# EAGLE design ButoMat (EAGLE 7.1.0)
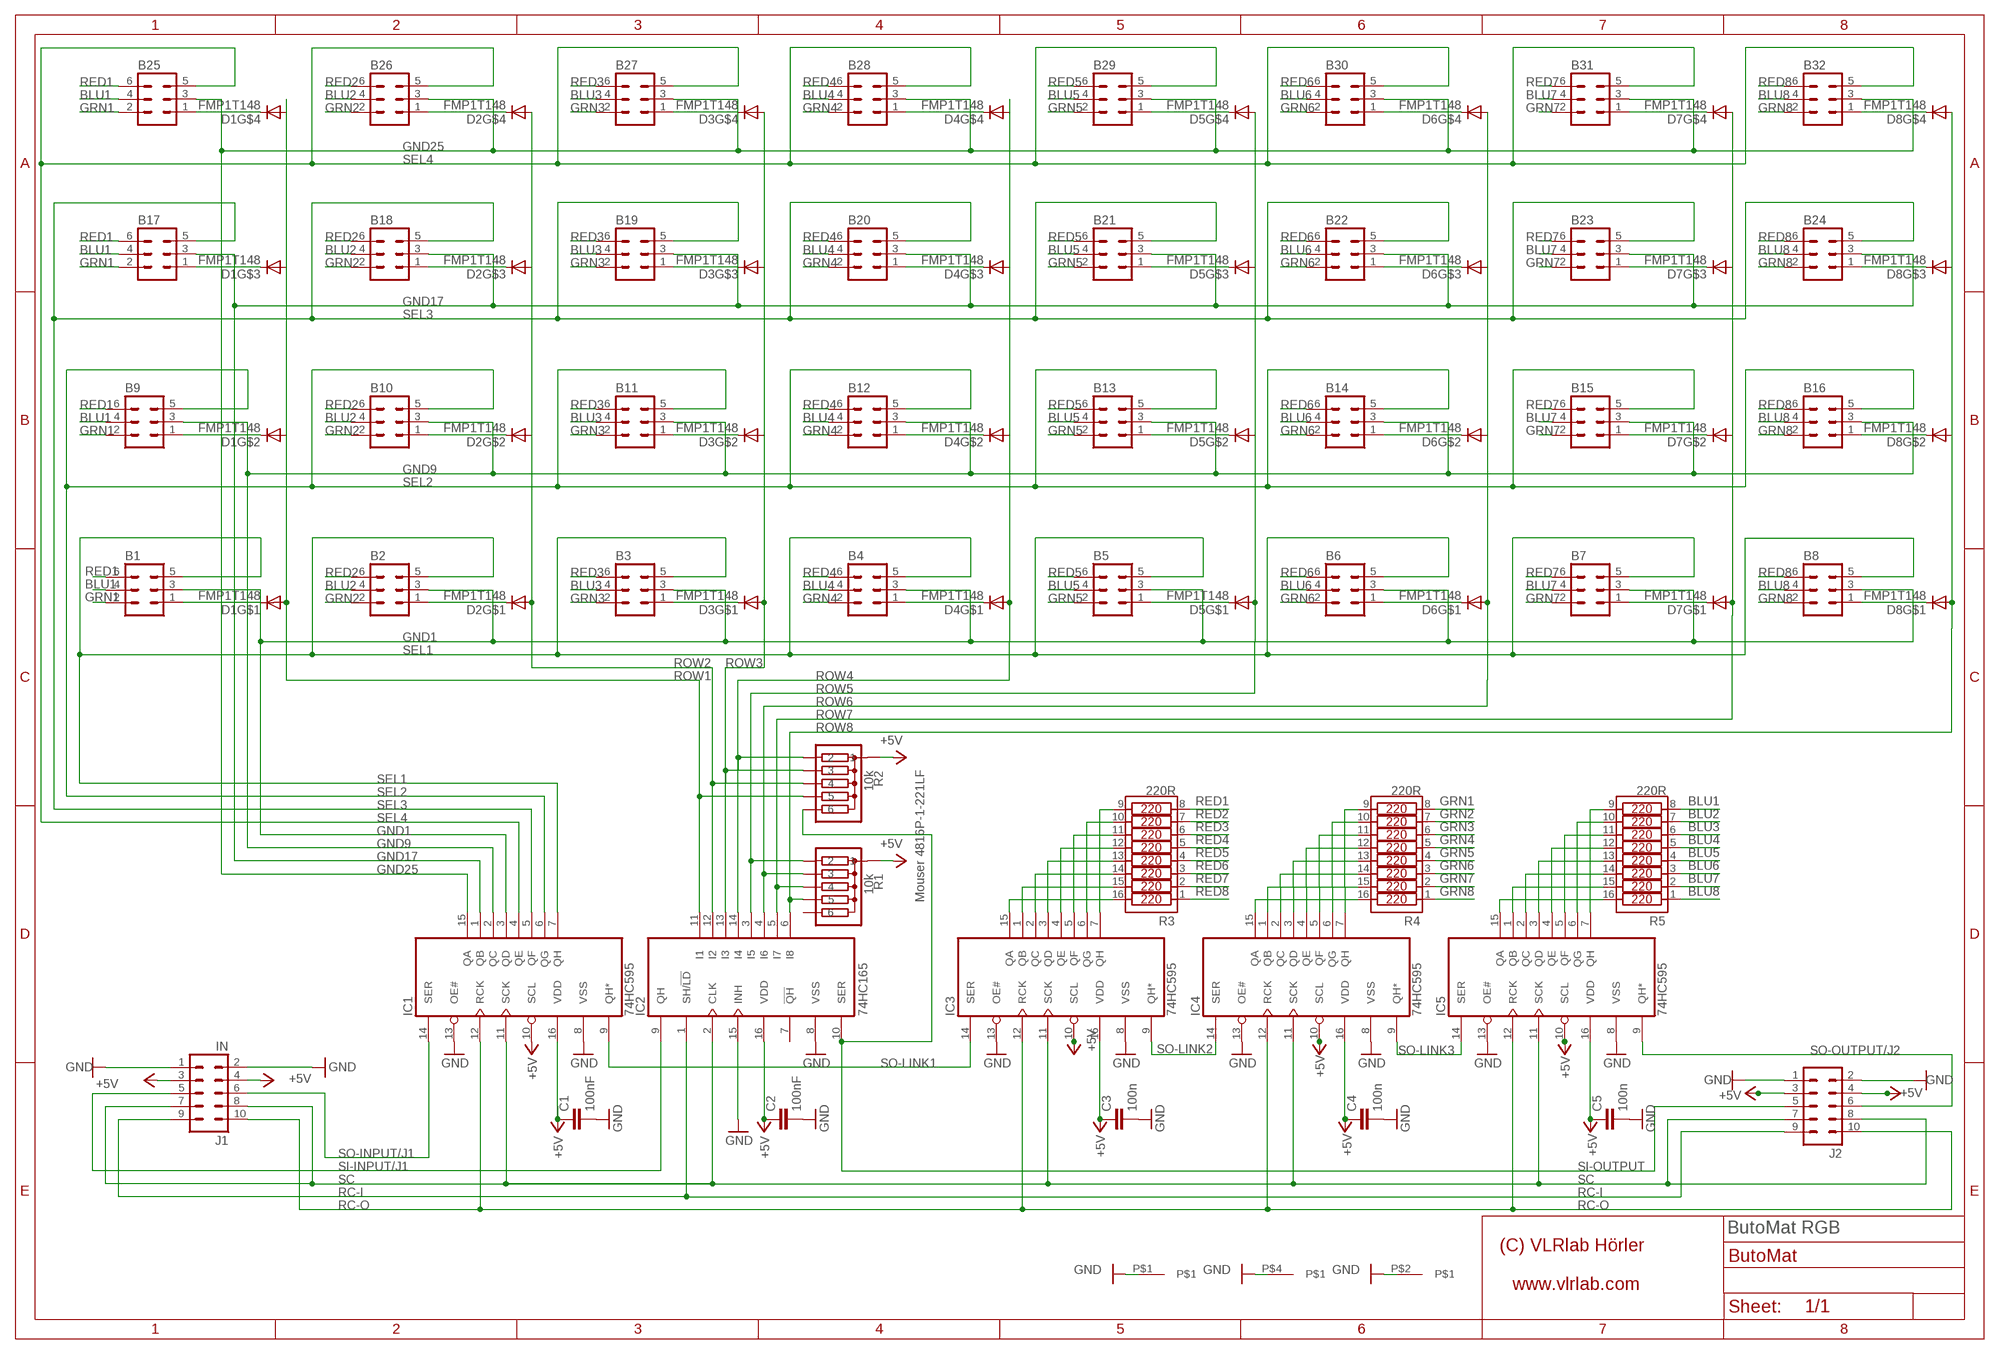
[diagram p0: schematic, sheet 1]

## Parts
B1  ML6  [ML6]
B2  ML6  [ML6]
B3  ML6  [ML6]
B4  ML6  [ML6]
B5  ML6  [ML6]
B6  ML6  [ML6]
B7  ML6  [ML6]
B8  ML6  [ML6]
B9  ML6  [ML6]
B10  ML6  [ML6]
B11  ML6  [ML6]
B12  ML6  [ML6]
B13  ML6  [ML6]
B14  ML6  [ML6]
B15  ML6  [ML6]
B16  ML6  [ML6]
B17  ML6  [ML6]
B18  ML6  [ML6]
B19  ML6  [ML6]
B20  ML6  [ML6]
B21  ML6  [ML6]
B22  ML6  [ML6]
B23  ML6  [ML6]
B24  ML6  [ML6]
B25  ML6  [ML6]
B26  ML6  [ML6]
B27  ML6  [ML6]
B28  ML6  [ML6]
B29  ML6  [ML6]
B30  ML6  [ML6]
B31  ML6  [ML6]
B32  ML6  [ML6]
C1  100nF  C-EU025-030X050  [C025-030X050]
C2  100nF  C-EU025-030X050  [C025-030X050]
C3  100n  C-EU025-030X050  [C025-030X050]
C4  100n  C-EU025-030X050  [C025-030X050]
C5  100n  C-EU025-030X050  [C025-030X050]
D1  FMP1T148  [SC-74A]
D2  FMP1T148  [SC-74A]
D3  FMP1T148  [SC-74A]
D4  FMP1T148  [SC-74A]
D5  FMP1T148  [SC-74A]
D6  FMP1T148  [SC-74A]
D7  FMP1T148  [SC-74A]
D8  FMP1T148  [SC-74A]
IC1  74HC595  74HC595SO16D  [SO16D]
IC2  74HC165  74HC165NSO16D  [SO16D]
IC3  74HC595  74HC595SO16D  [SO16D]
IC4  74HC595  74HC595SO16D  [SO16D]
IC5  74HC595  74HC595SO16D  [SO16D]
J1  IN  ML10  [ML10]
J2  ML10  [ML10]
R1  10k  4306R  [SIL6]
R2  10k  4306R  [SIL6]
R3  220R  4816P-1SOIC16W  [SOIC16W]
R4  220R  4816P-1SOIC16W  [SOIC16W]
R5  220R  4816P-1SOIC16W  [SOIC16W]
U$1  MIDIBOX_HALF  [MIDIBOX14X6]

## Nets
+5V [VDD]: C1.1 C2.1 C3.1 C4.1 C5.1 IC1.10(SCL) IC1.16(VDD) IC2.16(VDD) IC3.10(SCL) IC3.16(VDD) IC4.10(SCL) IC4.16(VDD) IC5.10(SCL) IC5.16(VDD) J1.3 J1.4 J2.3 J2.4 R1.1 R2.1
BLU1: B1.4 B9.4 B17.4 B25.4 R5.8
BLU2: B2.4 B10.4 B18.4 B26.4 R5.7
BLU3: B3.4 B11.4 B19.4 B27.4 R5.6
BLU4: B4.4 B12.4 B20.4 B28.4 R5.5
BLU5: B5.4 B13.4 B21.4 B29.4 R5.4
BLU6: B6.4 B14.4 B22.4 B30.4 R5.3
BLU7: B7.4 B15.4 B23.4 B31.4 R5.2
BLU8: B8.4 B16.4 B24.4 B32.4 R5.1
GND: C1.2 C2.2 C3.2 C4.2 C5.2 IC1.8(VSS) IC1.13(OE#) IC2.8(VSS) IC2.15(INH) IC3.8(VSS) IC3.13(OE#) IC4.8(VSS) IC4.13(OE#) IC5.8(VSS) IC5.13(OE#) J1.1 J1.2 J2.1 J2.2 U$1.P$1 U$1.P$2 U$1.P$4
GND1: B1.3 B2.3 B3.3 B4.3 B5.3 B6.3 B7.3 B8.3 IC1.3(QD)
GND9: B9.3 B10.3 B11.3 B12.3 B13.3 B14.3 B15.3 B16.3 IC1.2(QC)
GND17: B17.3 B18.3 B19.3 B20.3 B21.3 B22.3 B23.3 B24.3 IC1.1(QB)
GND25: B25.3 B26.3 B27.3 B28.3 B29.3 B30.3 B31.3 B32.3 IC1.15(QA)
GRN1: B1.2 B9.2 B17.2 B25.2 R4.8
GRN2: B2.2 B10.2 B18.2 B26.2 R4.7
GRN3: B3.2 B11.2 B19.2 B27.2 R4.6
GRN4: B4.2 B12.2 B20.2 B28.2 R4.5
GRN5: B5.2 B13.2 B21.2 B29.2 R4.4
GRN6: B6.2 B14.2 B22.2 B30.2 R4.3
GRN7: B7.2 B15.2 B23.2 B31.2 R4.2
GRN8: B8.2 B16.2 B24.2 B32.2 R4.1
N$1: B17.1 D1.K$3(C)
N$2: B9.1 D1.K$2(C)
N$3: B1.1 D1.K$1(C)
N$4: B18.1 D2.K$3(C)
N$5: B10.1 D2.K$2(C)
N$6: B2.1 D2.K$1(C)
N$7: B19.1 D3.K$3(C)
N$8: B11.1 D3.K$2(C)
N$9: IC5.15(QA) R5.16
N$10: IC5.1(QB) R5.15
N$11: IC5.2(QC) R5.14
N$12: IC5.3(QD) R5.13
N$13: IC5.4(QE) R5.12
N$14: IC5.5(QF) R5.11
N$15: IC5.6(QG) R5.10
N$16: IC5.7(QH) R5.9
N$17: IC3.15(QA) R3.16
N$18: IC3.1(QB) R3.15
N$19: IC3.2(QC) R3.14
N$20: IC3.3(QD) R3.13
N$21: IC3.4(QE) R3.12
N$22: IC3.5(QF) R3.11
N$23: IC3.6(QG) R3.10
N$24: IC3.7(QH) R3.9
N$25: B25.1 D1.K$4(C)
N$26: B26.1 D2.K$4(C)
N$27: B27.1 D3.K$4(C)
N$28: B28.1 D4.K$4(C)
N$29: B29.1 D5.K$4(C)
N$30: B30.1 D6.K$4(C)
N$31: B31.1 D7.K$4(C)
N$32: B32.1 D8.K$4(C)
N$65: IC4.15(QA) R4.16
N$66: IC4.1(QB) R4.15
N$67: IC4.2(QC) R4.14
N$68: IC4.3(QD) R4.13
N$69: IC4.4(QE) R4.12
N$70: IC4.5(QF) R4.11
N$71: IC4.6(QG) R4.10
N$72: IC4.7(QH) R4.9
N$73: B3.1 D3.K$1(C)
N$74: B20.1 D4.K$3(C)
N$75: B12.1 D4.K$2(C)
N$76: B4.1 D4.K$1(C)
N$77: B21.1 D5.K$3(C)
N$78: B13.1 D5.K$2(C)
N$79: B5.1 D5.K$1(C)
N$80: B22.1 D6.K$3(C)
N$81: B14.1 D6.K$2(C)
N$82: B6.1 D6.K$1(C)
N$83: B7.1 D7.K$1(C)
N$84: B15.1 D7.K$2(C)
N$85: B23.1 D7.K$3(C)
N$86: B24.1 D8.K$3(C)
N$87: B16.1 D8.K$2(C)
N$88: B8.1 D8.K$1(C)
RC-I: IC2.1(SH/!LD) J1.9 J2.9
RC-O: IC1.12(RCK) IC3.12(RCK) IC4.12(RCK) IC5.12(RCK) J1.10 J2.10
RED1: B1.6 B9.6 B17.6 B25.6 R3.8
RED2: B2.6 B10.6 B18.6 B26.6 R3.7
RED3: B3.6 B11.6 B19.6 B27.6 R3.6
RED4: B4.6 B12.6 B20.6 B28.6 R3.5
RED5: B5.6 B13.6 B21.6 B29.6 R3.4
RED6: B6.6 B14.6 B22.6 B30.6 R3.3
RED7: B7.6 B15.6 B23.6 B31.6 R3.2
RED8: B8.6 B16.6 B24.6 B32.6 R3.1
ROW1: D1.ANODE(A) IC2.11(I1) R2.5
ROW2: D2.ANODE(A) IC2.12(I2) R2.4
ROW3: D3.ANODE(A) IC2.13(I3) R2.3
ROW4: D4.ANODE(A) IC2.14(I4) R2.2
ROW5: D5.ANODE(A) IC2.3(I5) R1.2
ROW6: D6.ANODE(A) IC2.4(I6) R1.3
ROW7: D7.ANODE(A) IC2.5(I7) R1.4
ROW8: D8.ANODE(A) IC2.6(I8) R1.5
SC: IC1.11(SCK) IC2.2(CLK) IC3.11(SCK) IC4.11(SCK) IC5.11(SCK) J1.7 J1.8 J2.7 J2.8
SEL1: B1.5 B2.5 B3.5 B4.5 B5.5 B6.5 B7.5 B8.5 IC1.7(QH)
SEL2: B9.5 B10.5 B11.5 B12.5 B13.5 B14.5 B15.5 B16.5 IC1.6(QG)
SEL3: B17.5 B18.5 B19.5 B20.5 B21.5 B22.5 B23.5 B24.5 IC1.5(QF)
SEL4: B25.5 B26.5 B27.5 B28.5 B29.5 B30.5 B31.5 B32.5 IC1.4(QE)
SI-INPUT/J1: IC2.9(QH) J1.5
SI-OUTPUT: IC2.10(SER) J2.5 R2.6
SO-INPUT/J1: IC1.14(SER) J1.6
SO-LINK1: IC1.9(QH*) IC3.14(SER)
SO-LINK2: IC3.9(QH*) IC4.14(SER)
SO-LINK3: IC4.9(QH*) IC5.14(SER)
SO-OUTPUT/J2: IC5.9(QH*) J2.6
Unconnected: IC2.7(!QH) R1.6

## Notes on the sheet
- Mouser 4816P-1-221LF
- ButoMat RGB

## Library data of the parts
B1-B32 = con-ml_Ivan:ML6: HARTING; OC_FARNELL: unknown; OC_NEWARK: unknown
C1-C5 = rcl:C-EU: CAPACITOR, European symbol
D1-D8 = Diode:FMP1T148
IC1 IC3-IC5 = 595-541-165-uln2803:74HC595
IC2 = 595-541-165-uln2803:74HC165N
J1 = con-harting-ml:ML10: HARTING; OC_FARNELL: unknown; OC_NEWARK: unknown
J2 = con-ml:ML10: HARTING; OC_FARNELL: unknown; OC_NEWARK: unknown
R1 R2 = Bourns Resistor Array:4306R
R3-R5 = Bourns Resistor Array:4816P-1
U$1 = Frames_VLR:MIDIBOX_HALF

## Net classes
1 VDD: width 0.61 mm, drill 0.33 mm, clearance 0.355 mm to class 0, clearance 0.355 mm

## Board
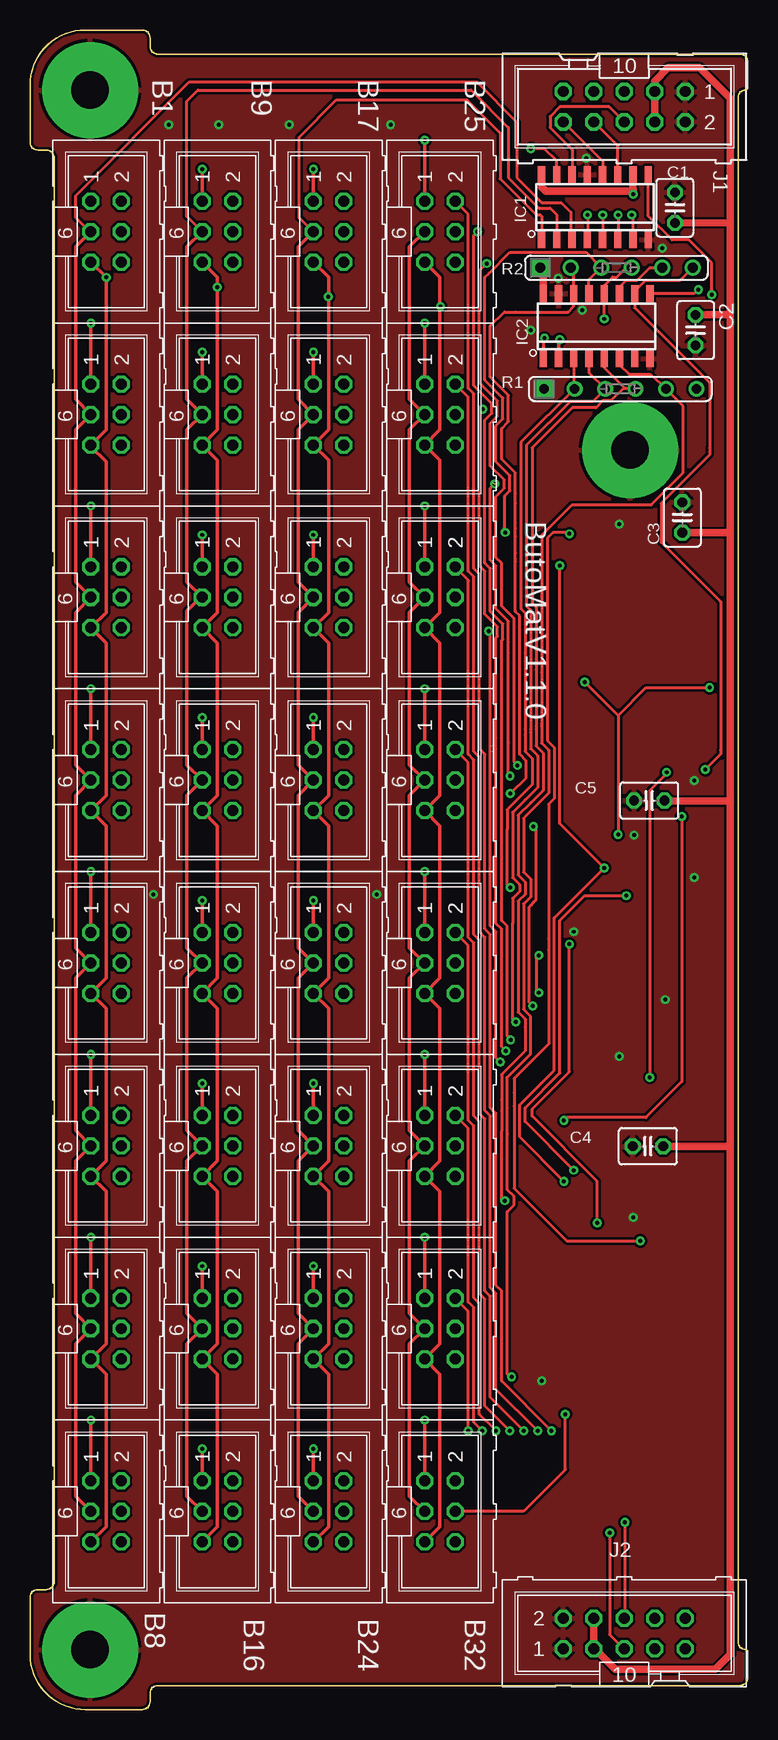
[diagram p1: board, top side]
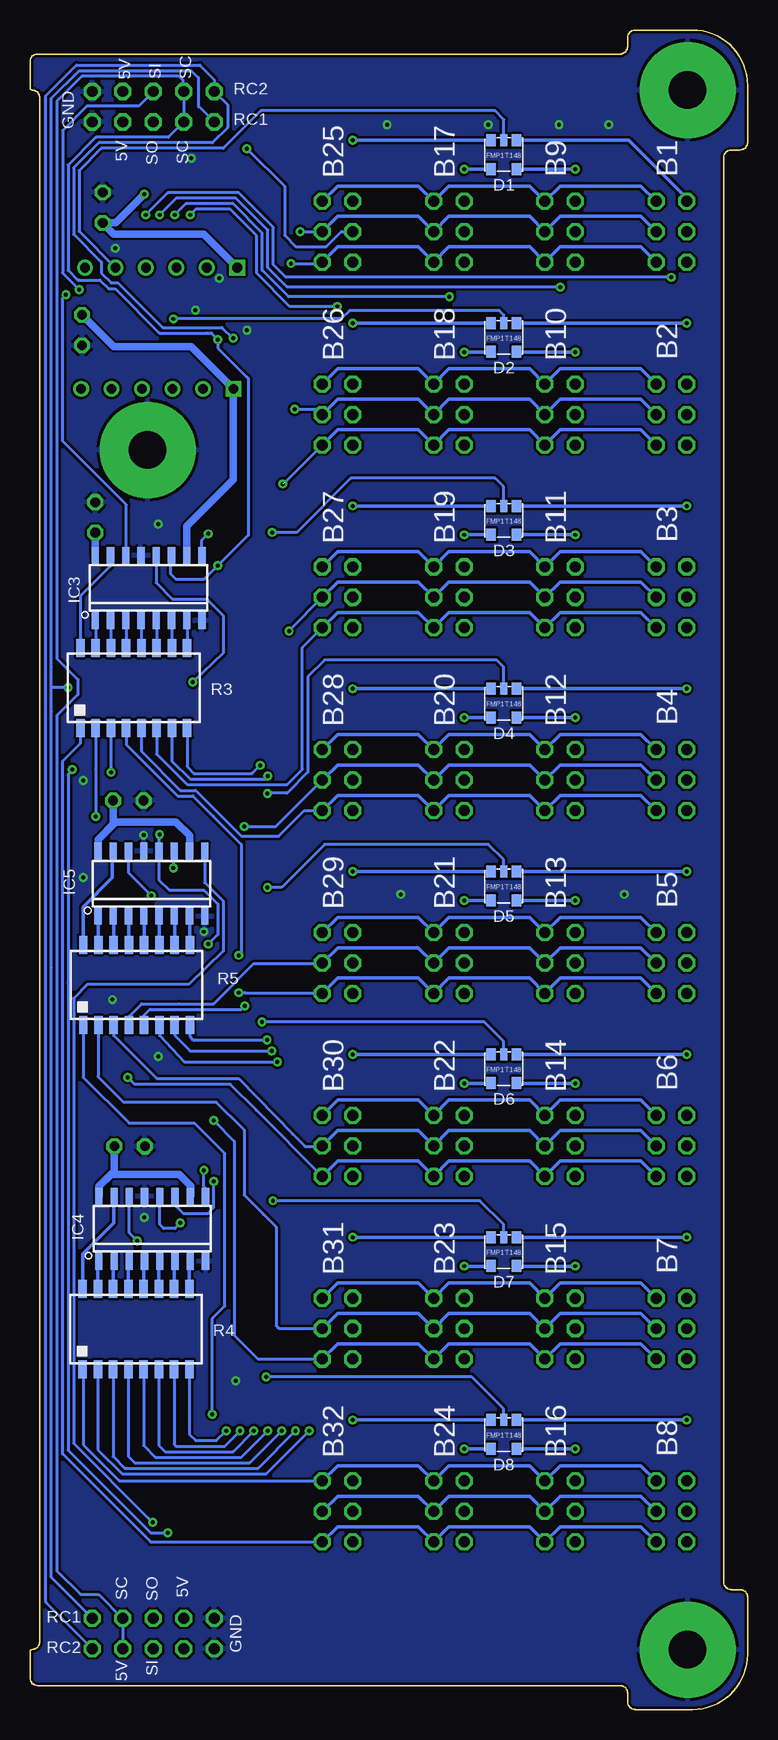
[diagram p2: board, bottom side, seen from below]

Size 59.8 x 140 mm. Coordinates in mm from the lower left corner, seen from the top.
Copper layers (1*16): Top 0.035mm / dielectric 1.5mm / Bottom 0.035mm
Design rules "default *": minimum track width 10mil, minimum drill 24mil, track to track 8mil, track to pad 8mil, pad to pad 8mil, via to via 8mil, smd to smd 8mil, copper to edge 8mil, drill to drill 8mil, minimum pad ring 10mil, minimum via ring 8mil, stop-mask expansion 4mil, vias tented up to drill 0mil, thermal gap 10mil

### Footprints (pad centres in the part's own frame; a part is rotated, then mirrored left to right if it is on the bottom)
ML6 = drill 0.914 octagon: 1 -2.54,-1.27; 2 -2.54,1.27; 3 0,-1.27; 4 0,1.27; 5 2.54,-1.27; 6 2.54,1.27
C025-030X050 = drill 0.813 octagon: 1 -1.27,0; 2 1.27,0
SC-74A = smd 0.6 x 1: ANODE 0,0 | smd 0.8 x 1: K$1 -1.05,0; K$2 -1.05,2.4; K$3 1.05,2.4; K$4 1.05,0
SO16D = smd 0.6 x 1.4: 1 -4.481,-2.764; 2 -3.211,-2.764; 3 -1.941,-2.764; 4 -0.671,-2.764; 5 0.599,-2.764; 6 1.869,-2.764; 7 3.139,-2.764; 8 4.409,-2.764; 9 4.409,2.666; 10 3.139,2.666; 11 1.869,2.666; 12 0.599,2.666; 13 -0.671,2.666; 14 -1.941,2.666; 15 -3.211,2.666; 16 -4.481,2.666
ML10 = drill 0.914 octagon: 1 -5.08,-1.27; 2 -5.08,1.27; 3 -2.54,-1.27; 4 -2.54,1.27; 5 0,-1.27; 6 0,1.27; 7 2.54,-1.27; 8 2.54,1.27; 9 5.08,-1.27; 10 5.08,1.27
SIL6 = drill 0.813 square: 1 -6.35,0 | drill 0.813: 2 -3.81,0; 3 -1.27,0; 4 1.27,0; 5 3.81,0; 6 6.35,0
SOIC16W = smd 0.7 x 1.5: 1 -4.445,-3.346; 2 -3.175,-3.346; 3 -1.905,-3.346; 4 -0.635,-3.346; 5 0.635,-3.346; 6 1.905,-3.346; 7 3.175,-3.346; 8 4.445,-3.346; 9 4.445,3.346; 10 3.175,3.346; 11 1.905,3.346; 12 0.635,3.346; 13 -0.635,3.346; 14 -1.905,3.346; 15 -3.175,3.346; 16 -4.445,3.346
MIDIBOX14X6 = drill 3.1 pad 8: P$1 5,135; P$2 50,105; P$4 5,5

### Placement (x,y rotation side)
B1  6.35,123.19 270 top
B2  6.35,107.95 270 top
B3  6.35,92.71 270 top
B4  6.35,77.47 270 top
B5  6.35,62.23 270 top
B6  6.35,46.99 270 top
B7  6.35,31.75 270 top
B8  6.35,16.51 270 top
B9  15.62,123.19 270 top
B10  15.62,107.95 270 top
B11  15.62,92.71 270 top
B12  15.62,77.47 270 top
B13  15.62,62.23 270 top
B14  15.62,46.99 270 top
B15  15.62,31.75 270 top
B16  15.62,16.51 270 top
B17  24.89,123.19 270 top
B18  24.89,107.95 270 top
B19  24.89,92.71 270 top
B20  24.89,77.47 270 top
B21  24.89,62.23 270 top
B22  24.89,46.99 270 top
B23  24.89,31.75 270 top
B24  24.89,16.51 270 top
B25  34.16,123.19 270 top
B26  34.16,107.95 270 top
B27  34.16,92.71 270 top
B28  34.16,77.47 270 top
B29  34.16,62.23 270 top
B30  34.16,46.99 270 top
B31  34.16,31.75 270 top
B32  34.16,16.51 270 top
C1  53.74,125.19 90 top
C2  55.46,114.98 270 top
C3  54.36,99.36 90 top
C4  51.5,46.95 180 top
C5  51.61,75.76 180 top
D1  20.32,130.81 180 bottom
D2  20.32,115.57 180 bottom
D3  20.32,100.33 180 bottom
D4  20.32,85.09 180 bottom
D5  20.32,69.85 180 bottom
D6  20.32,54.61 180 bottom
D7  20.32,39.37 180 bottom
D8  20.32,24.13 180 bottom
IC1  47.11,125.27 0 top
IC2  47.25,115.36 0 top
IC3  49.88,93.53 0 bottom
IC4  49.58,40.12 0 bottom
IC5  49.65,68.89 0 bottom
J1  49.53,133.6 180 top
J2  49.53,6.35 0 top
R1  49.19,110.09 0 top
R2  48.87,120.19 0 top
R3  51.15,85.15 0 bottom
R4  50.97,31.7 0 bottom
R5  50.92,60.4 0 bottom
U$1  0,0 0 top
U$3  [VLRLAB]  48.9,33.02 270 top

### Tracks (layer width: path | path; a pad name or v marks a point on that pad's centre or on a via)
+5V  (via drill 0.33)
  Top 0.406: 42.99,126.55 50.04,126.55 50.27,126.61 50.25,126.99 50.27,127.13 50.27,127.24
  Top 0.61: 58.36,46.95 58.36,4.62 57.09,3.35 48.77,3.35 47.04,5.08 J2.3 J2.4 | 58.36,46.95 58.36,75.74 | 58.36,75.74 58.36,98.12 | 58.36,98.12 58.36,101.01 58.36,116.26 | 58.36,116.26 58.36,123.89 | 58.36,123.89 58.36,134.29 55.82,136.84 53.16,136.84 52.07,135.74 J1.3 J1.4 | C2.1 56.32,116.26 58.36,116.26 | R2.1 42.77,119.94 IC2.16 | C5.1 52.9,75.74 58.36,75.74 | C4.1 58.36,46.95 | IC1.16 42.65,127.92 42.65,126.9 42.99,126.55 50.04,126.55 50.27,126.61 | IC1.10 50.25,126.99 50.27,126.61 | C3.1 54.38,98.12 58.36,98.12 | v50.27,126.32 50.27,126.61 | 58.36,123.89 C1.1
  Bottom 0.61: R2.1 45.3,122.97 52.81,122.97 C1.1 52.67,123.92 v50.27,126.32 | C2.1 55.43,116.22 52.81,113.61 46.36,113.61 R1.1 42.84,102.52 46.74,98.63 IC3.10 | IC3.16 54.36,96.9 C3.1 | IC5.10 46.51,72.84 47.63,73.97 52.7,73.97 54.13,72.53 IC5.16 54.13,72.51 52.7,73.93 52.7,73.96 52.88,74.01 C5.1 | IC4.10 46.41,42.82 46.41,43.64 47.38,44.61 53.05,44.61 54.06,43.6 IC4.16 54.03,42.82 54.03,43.64 53.03,44.63 53.01,44.63 52.77,44.87 C4.1
BLU1  (via drill 0.33)
  Top 0.254: v40.05,55.82 40.1,55.82 39.76,56.17 39.76,65.3 39.29,65.76 39.29,80.32 39.29,81.25 39.29,89.1 39.41,89.22 39.41,90.49 38.37,91.53 38.37,95.11 37.91,95.58 37.91,107.48 38.48,108.06 38.48,108.87 36.98,110.37 36.98,122.89 v37.29,123.2
  Bottom 0.254: R5.8 46.48,56.18 46.23,55.82 46,55.82 v40.05,55.82 | v37.29,123.2 35.44,123.2 B25.4
  Bottom 0.305: B1.4 8.89,124.46 15.62,124.46 B9.4 18.16,124.46 24.89,124.46 B17.4 27.43,124.46 34.16,124.46 B25.4
BLU2  (via drill 0.33)
  Top 0.254: 39.29,55.7 | 39.29,55.7 39.29,65.07 38.83,65.53 38.83,80.09 38.83,81.02 38.83,89.34 38.95,89.45 38.95,90.26 37.91,91.3 37.91,94.88 37.45,95.34 37.45,108.17 v37.73,108.41 | v39.64,54.9 39.29,55.24 39.29,55.7 | 39.29,55.7
  Bottom 0.254: v37.73,108.41 35.89,108.41 B26.4 | R5.7 47.73,57.04 47.73,56.17 46.46,54.9 v39.64,54.9
  Bottom 0.305: B2.4 8.89,109.22 15.62,109.22 B10.4 18.16,109.22 24.89,109.22 B18.4 27.43,109.22 34.16,109.22 B26.4
BLU3  (via drill 0.33)
  Top 0.254: v39.18,53.97 38.83,54.32 38.83,64.83 38.37,65.3 38.37,79.86 38.37,80.32 38.37,89.68 38.14,89.91 v38.21,89.91
  Bottom 0.254: R5.6 49,56.17 46.94,53.98 | 46.94,53.98 | 46.94,53.98 v39.18,53.97 | v38.21,89.91 38.11,90.03 B27.4
  Bottom 0.305: B3.4 8.89,93.98 15.62,93.98 B11.4 18.16,93.98 24.89,93.98 B19.4 27.43,93.98 34.16,93.98 B27.4
BLU4  (via drill 0.33)
  Top 0.254: v41.89,58.65 41.6,58.94 41.6,66.92 41.72,67.03 41.95,67.26 42.18,67.49 42.18,69.46 42.18,70.03 42.18,73.27 v41.95,73.62
  Bottom 0.254: B28.4 35.48,77.43 39.3,73.61 39.31,73.62 v41.95,73.62 | R5.5 50.29,57.89 50.27,57.9 49.81,58.36 42.18,58.36 v41.89,58.65
  Bottom 0.305: B4.4 8.89,78.74 15.62,78.74 B12.4 18.16,78.74 24.89,78.74 B20.4 27.43,78.74 34.16,78.74 B28.4
BLU5
  Bottom 0.254: B29.4 35.49,62.18 40.91,62.18 41.14,62.18 44.49,58.83 47.38,58.83 50.5,58.83 51.54,57.78 51.56,57.77 R5.4
  Bottom 0.305: B5.4 8.89,63.5 15.62,63.5 B13.4 18.16,63.5 24.89,63.5 B21.4 27.43,63.5 34.16,63.5 B29.4
BLU6
  Bottom 0.254: R5.3 52.83,56.18 49.23,52.58 42.41,52.58 37.91,47.96 36.87,46.92 35.5,46.92 B30.4
  Bottom 0.305: B6.4 8.89,48.26 15.62,48.26 B14.4 18.16,48.26 24.89,48.26 B22.4 27.43,48.26 34.16,48.26 B30.4
BLU7
  Bottom 0.254: R5.2 54.1,52.82 54.1,52.71 52.01,50.62 44.26,50.62 42.07,48.42 41.95,48.31 41.95,42.88 40.33,41.26 | 40.33,41.26 | 40.33,41.26 39.29,40.22 39.29,32.01 39.06,31.78 35.47,31.78 B31.4
  Bottom 0.305: B7.4 8.89,33.02 15.62,33.02 B15.4 18.16,33.02 24.89,33.02 B23.4 27.43,33.02 34.16,33.02 B31.4
BLU8  (via drill 0.33)
  Top 0.254: B32.4 35.45,16.53 41.14,16.53 44.61,19.99 v44.61,24.62
  Bottom 0.254: R5.1 55.37,52.71 51.54,48.89 46.11,48.89 44.61,47.38 43.57,46.34 43.57,33.63 44.61,32.59 v44.61,24.62
  Bottom 0.305: B8.4 8.89,17.78 15.62,17.78 B16.4 18.16,17.78 24.89,17.78 B24.4 27.43,17.78 34.16,17.78 B32.4
GND  (via drill 0.33)
  other vias: 46.34,129.32 50.34,72.88 44.03,119.33 52.7,121.81 46.01,116.64 55.36,77.43 55.36,69.34 49.12,98.81 52.93,59.17 49.12,54.43 50.27,41.03 42.65,27.39 10.29,67.96 28.89,67.96 45.3,64.83 11.56,132.1 15.72,132.1 30.05,132.1 21.61,132.1 41.72,114.99
  pour Top: 0,140 60,140 60,0 0,0
  pour Bottom: 0,140 60,140 60,0 0,0
GND1
  Top 0.254: B1.3 4.98,123.19 3.81,124.35 3.81,126.2 13.29,135.68 37.21,135.68 40.56,132.33 40.56,127.7 42.65,125.62 44.26,125.62 45.07,124.82 45.07,122.61 IC1.3
  Top 0.305: B1.3 3.81,121.92 3.81,109.22 B2.3 3.81,106.68 3.81,93.98 B3.3 3.81,91.44 3.81,78.74 B4.3 3.81,76.2 3.81,63.5 B5.3 3.81,60.96 3.81,48.26 B6.3 3.81,45.72 3.81,33.02 B7.3 3.81,30.48 3.81,17.78 B8.3
GND9
  Top 0.254: B9.3 14.34,123.19 13.06,124.47 13.06,134.06 13.98,134.99 36.75,134.99 39.87,131.87 39.87,127.7 42.41,125.16 43.34,125.16 43.92,124.58 43.92,122.53 IC1.2
  Top 0.305: B16.3 13.08,17.78 13.08,30.48 B15.3 13.08,33.02 13.08,45.72 B14.3 13.08,48.26 13.08,60.96 B13.3 13.08,63.5 13.08,76.2 B12.3 13.08,78.74 13.08,91.57 14.22,92.71 B11.3 13.08,93.98 13.08,106.68 B10.3 13.08,109.22 13.08,121.92 B9.3
GND17
  Top 0.254: B17.3 23.58,123.19 22.42,124.35 22.42,131.06 25.54,134.18 36.41,134.18 39.18,131.4 39.18,127.59 42.18,124.58 42.53,124.58 42.65,124.47 42.65,122.53 IC1.1
  Top 0.305: B17.3 22.35,121.92 22.35,109.22 B18.3 22.35,106.68 22.35,93.98 B19.3 22.35,91.44 22.35,78.74 B20.3 22.35,76.2 22.35,63.5 B21.3 22.35,60.96 22.35,48.26 B22.3 22.35,45.72 22.35,33.02 B23.3 22.35,30.48 22.35,17.78 B24.3
GND25  (via drill 0.33)
  Top 0.203: IC1.15 43.88,127.94
  Top 0.254: 43.88,127.94 43.88,129.1 42.86,130.11 v41.74,130.11
  Top 0.305: B25.3 31.62,121.92 31.62,111.76 31.62,109.22 B26.3 31.62,106.68 31.62,93.98 B27.3 31.62,91.44 31.62,78.74 B28.3 31.62,76.2 31.62,63.5 B29.3 31.62,60.96 31.62,48.26 B30.3 31.62,45.72 31.62,33.02 B31.3 31.62,30.48 31.62,17.78 B32.3
  Bottom 0.254: v41.74,130.11 38.59,126.96 38.59,122.88 37.66,121.95 35.09,121.95 33.85,123.19 B25.3
GRN1  (via drill 0.33)
  Top 0.254: v43.45,23.23 39.29,27.39 39.29,34.9 38.83,35.36 38.83,49.7 38.37,50.16 38.37,64.6 37.91,65.07 37.91,79.63 37.45,80.09 37.45,94.65 36.98,95.11 36.98,109.68 36.52,110.14 36.52,124.64 B25.2
  Bottom 0.254: R4.8 46.52,22.94 46,22.42 44.26,22.42 v43.45,23.23
  Bottom 0.305: B1.2 8.89,127 15.62,127 B9.2 18.16,127 24.89,127 B17.2 27.43,127 34.16,127 B25.2
GRN2  (via drill 0.33)
  Top 0.254: v42.3,23.23 38.83,26.7 38.83,34.67 38.37,35.13 38.37,49.46 37.91,49.93 37.91,64.37 37.45,64.83 37.45,79.4 36.98,79.86 36.98,94.42 36.52,94.88 36.52,109.33 36.52,109.4 B26.2
  Bottom 0.254: R4.7 47.79,22.13 47.62,21.96 43.57,21.96 v42.3,23.23
  Bottom 0.305: B2.2 8.89,111.76 15.62,111.76 B10.2 18.16,111.76 24.77,111.76 24.89,111.76 B18.2 27.43,111.76 34.16,111.76 B26.2
GRN3  (via drill 0.33)
  Top 0.254: v41.14,23.23 38.37,26 38.37,34.44 37.91,34.9 37.91,49.23 37.45,49.7 37.45,64.14 36.98,64.6 36.98,79.17 36.52,79.63 36.52,94.07 | 36.52,94.07 36.52,94.16 | 36.52,94.16 36.52,94.07 | 36.52,94.07 36.52,94.16 | 36.52,94.16 B27.2
  Bottom 0.254: R4.6 49.06,22.02 48.54,21.5 42.88,21.5 v41.14,23.23
  Bottom 0.305: B3.2 8.89,96.52 15.62,96.52 B11.2 18.16,96.52 24.89,96.52 B19.2 27.43,96.52 34.16,96.52 B27.2
GRN4  (via drill 0.33)
  Top 0.254: v39.99,23.23 37.91,25.31 37.91,34.21 37.45,34.67 37.45,49 | 37.45,49 | 37.45,49 36.98,49.46 36.98,63.91 | 36.98,63.91 | 36.98,63.91 36.52,64.37 36.52,78.92 | 36.52,78.92 36.52,78.93 36.52,78.92 | 36.52,78.92 B28.2
  Bottom 0.254: R4.5 50.33,22.02 49.35,21.03 42.18,21.03 v39.99,23.23
  Bottom 0.305: B4.2 8.89,81.28 15.62,81.28 B12.2 18.16,81.28 24.89,81.28 B20.2 27.43,81.28 34.16,81.28 B28.2
GRN5  (via drill 0.33)
  Top 0.254: v38.83,23.23 38.72,23.34 37.45,24.62 37.45,33.86 36.98,34.32 36.98,48.66 36.52,49.12 36.52,63.68 | 36.52,63.68 | 36.52,63.68 B29.2
  Bottom 0.254: R4.4 51.6,21.09 51.08,20.57 41.49,20.57 v38.83,23.23
  Bottom 0.305: B5.2 8.89,66.04 15.62,66.04 B13.2 18.16,66.04 24.89,66.04 B21.2 27.43,66.04 34.16,66.04 B29.2
GRN6  (via drill 0.33)
  Top 0.254: v37.68,23.23 36.98,23.92 36.98,33.52 36.52,33.98 36.52,48.42 36.52,48.44 B30.2
  Bottom 0.254: R4.3 52.87,21.09 51.89,20.11 40.8,20.11 v37.68,23.23
  Bottom 0.305: B6.2 8.89,50.8 15.62,50.8 B14.2 18.16,50.8 24.89,50.8 B22.2 27.43,50.8 34.16,50.8 B30.2
GRN7  (via drill 0.33)
  Top 0.254: v36.52,23.23 36.52,33.2 B31.2
  Bottom 0.254: R4.2 54.14,21.66 52.12,19.65 40.1,19.65 v36.52,23.23
  Bottom 0.305: B7.2 8.89,35.56 15.62,35.56 B15.2 18.16,35.56 24.89,35.56 B23.2 27.43,35.56 34.16,35.56 B31.2
GRN8
  Bottom 0.254: R4.1 55.41,27.79 55.36,27.74 55.36,22.07 52.35,19.07 35.45,19.07 B32.2
  Bottom 0.305: B8.2 8.89,20.32 15.62,20.32 B16.2 18.16,20.32 24.89,20.32 B24.2 27.43,20.32 34.16,20.32 B32.2
N$1  (via drill 0.33)
  Top 0.305: v23.62,128.4 B17.1
  Bottom 0.305: D1.K$3 21.38,128.4 v23.62,128.4
N$2  (via drill 0.33)
  Top 0.305: v14.35,128.4 B9.1
  Bottom 0.305: D1.K$2 19.26,128.4 v14.35,128.4
N$3
  Bottom 0.305: D1.K$1 10.54,130.81 10.29,130.81 9.91,130.81 5.08,125.98 B1.1
N$4  (via drill 0.33)
  Top 0.305: v23.62,113.16 B18.1
  Bottom 0.305: D2.K$3 21.38,113.16 v23.62,113.16
N$5  (via drill 0.33)
  Top 0.305: v14.35,113.16 B10.1
  Bottom 0.305: D2.K$2 19.26,113.16 v14.35,113.16
N$6  (via drill 0.33)
  Top 0.305: v5.08,115.57 B2.1
  Bottom 0.305: D2.K$1 v5.08,115.57
N$7  (via drill 0.33)
  Top 0.305: v23.62,97.92 B19.1
  Bottom 0.305: D3.K$3 21.38,97.92 v23.62,97.92
N$8  (via drill 0.33)
  Top 0.305: v14.35,97.92 B11.1
  Bottom 0.305: D3.K$2 19.26,97.92 v14.35,97.92
N$9
  Bottom 0.305: IC5.15 52.93,71.48 52.93,69.34 55.37,66.91 R5.16
N$10
  Bottom 0.305: IC5.1 54.1,66.09 R5.15
N$11
  Bottom 0.305: IC5.2 52.83,66.09 R5.14
N$12
  Bottom 0.305: IC5.3 51.56,66.09 R5.13
N$13
  Bottom 0.305: IC5.4 50.29,66.09 R5.12
N$14
  Bottom 0.305: IC5.5 49.02,66.09 R5.11
N$15
  Bottom 0.305: IC5.6 47.75,66.09 R5.10
N$16
  Bottom 0.305: IC5.7 46.48,66.09 R5.9
N$17
  Bottom 0.254: IC3.15 53.1,96.19 53.1,95.31 55.6,92.81 R3.16
N$18
  Bottom 0.254: IC3.1 54.33,90.73 R3.15
N$19
  Bottom 0.254: IC3.2 53.06,90.73 R3.14
N$20
  Bottom 0.254: IC3.3 51.79,90.73 R3.13
N$21
  Bottom 0.254: IC3.4 50.52,90.73 R3.12
N$22
  Bottom 0.254: IC3.5 49.25,90.73 R3.11
N$23
  Bottom 0.254: IC3.6 47.98,90.73 R3.10
N$24
  Bottom 0.254: IC3.7 46.71,90.73 R3.9
N$25  (via drill 0.33)
  Top 0.305: v32.89,130.81 B25.1
  Bottom 0.305: D1.K$4 v32.89,130.81
N$26  (via drill 0.33)
  Top 0.305: v32.89,115.57 B26.1
  Bottom 0.305: D2.K$4 v32.89,115.57
N$27  (via drill 0.33)
  Top 0.305: v32.89,100.33 B27.1
  Bottom 0.305: D3.K$4 v32.89,100.33
N$28  (via drill 0.33)
  Top 0.305: v32.89,85.09 B28.1
  Bottom 0.305: D4.K$4 v32.89,85.09
N$29  (via drill 0.33)
  Top 0.305: v32.89,69.85 B29.1
  Bottom 0.305: D5.K$4 v32.89,69.85
N$30  (via drill 0.33)
  Top 0.305: v32.89,54.61 B30.1
  Bottom 0.305: D6.K$4 v32.89,54.61
N$31  (via drill 0.33)
  Top 0.305: v32.89,39.37 B31.1
  Bottom 0.305: D7.K$4 v32.89,39.37
N$32  (via drill 0.33)
  Top 0.305: v32.89,24.13 B32.1
  Bottom 0.305: D8.K$4 v32.89,24.13
N$65
  Bottom 0.305: IC4.15 52.81,42.76 52.81,40.56 55.41,37.97 R4.16
N$66
  Bottom 0.305: IC4.1 54.14,37.28 R4.15
N$67
  Bottom 0.305: IC4.2 52.87,37.28 R4.14
N$68
  Bottom 0.305: IC4.3 51.6,37.28 R4.13
N$69
  Bottom 0.305: IC4.4 50.33,37.28 R4.12
N$70
  Bottom 0.305: IC4.5 49.06,37.28 R4.11
N$71
  Bottom 0.305: IC4.6 47.79,37.28 R4.10
N$72
  Bottom 0.305: IC4.7 46.52,37.28 R4.9
N$73  (via drill 0.33)
  Top 0.305: v5.08,100.33 B3.1
  Bottom 0.305: D3.K$1 v5.08,100.33
N$74  (via drill 0.33)
  Top 0.305: v23.62,82.68 B20.1
  Bottom 0.305: D4.K$3 21.38,82.68 v23.62,82.68
N$75  (via drill 0.33)
  Top 0.305: v14.35,82.68 B12.1
  Bottom 0.305: D4.K$2 19.26,82.68 v14.35,82.68
N$76  (via drill 0.33)
  Top 0.305: v5.08,85.09 B4.1
  Bottom 0.305: D4.K$1 v5.08,85.09
N$77  (via drill 0.33)
  Top 0.305: v23.62,67.44 B21.1
  Bottom 0.305: D5.K$3 21.38,67.44 v23.62,67.44
N$78  (via drill 0.33)
  Top 0.305: v14.35,67.44 B13.1
  Bottom 0.305: D5.K$2 19.26,67.44 v14.35,67.44
N$79  (via drill 0.33)
  Top 0.305: v5.08,69.85 B5.1
  Bottom 0.305: D5.K$1 v5.08,69.85
N$80  (via drill 0.33)
  Top 0.305: v23.62,52.2 B22.1
  Bottom 0.305: D6.K$3 21.38,52.2 v23.62,52.2
N$81  (via drill 0.33)
  Top 0.305: v14.35,52.2 B14.1
  Bottom 0.305: D6.K$2 19.26,52.2 v14.35,52.2
N$82  (via drill 0.33)
  Top 0.305: v5.08,54.61 B6.1
  Bottom 0.305: D6.K$1 v5.08,54.61
N$83  (via drill 0.33)
  Top 0.305: v5.08,39.37 B7.1
  Bottom 0.305: D7.K$1 v5.08,39.37
N$84  (via drill 0.33)
  Top 0.305: v14.35,36.96 B15.1
  Bottom 0.305: D7.K$2 19.26,36.96 v14.35,36.96
N$85  (via drill 0.33)
  Top 0.305: v23.62,36.96 B23.1
  Bottom 0.305: D7.K$3 21.38,36.96 v23.62,36.96
N$86  (via drill 0.33)
  Top 0.305: v23.62,21.72 B24.1
  Bottom 0.305: D8.K$3 21.38,21.72 v23.62,21.72
N$87  (via drill 0.33)
  Top 0.305: v14.35,21.72 B16.1
  Bottom 0.305: D8.K$2 19.26,21.72 v14.35,21.72
N$88  (via drill 0.33)
  Top 0.305: v5.08,24.13 B8.1
  Bottom 0.305: D8.K$1 v5.08,24.13
RC-I  (via drill 0.33)
  Top 0.254: v42.88,114.3 42.77,114.19 IC2.1
  Bottom 0.254: J2.9 58.48,8.95 58.48,134.52 55.94,137.07 45.65,137.07 44.45,135.87 J1.9 43.34,133.76 43.34,131.87 44.61,130.59 54.09,130.59 56.17,128.51 56.17,122.97 53.86,120.66 53.86,119.73 53.05,118.92 52.47,118.92 48.75,115.2 43.82,115.2 42.92,114.3 v42.88,114.3
RC-O  (via drill 0.33)
  Top 0.254: IC1.12 47.71,129.12 47.66,129.12 J1.10 | v47.27,40.56 47.27,44.03 41.84,49.46 41.84,50.04 44.73,52.93 44.96,53.16 v44.96,63.8 | v46.23,85.64 49,82.86 | 49,82.86 v49,72.92 | 49,82.86 51.31,85.17 v56.63,85.17
  Bottom 0.254: J2.10 58.02,11.03 58.02,61.83 58.02,83.21 58.02,85.17 | 58.02,85.17 58.02,86.91 58.02,134.29 55.7,136.6 46.34,136.6 45.77,136.03 45.77,133.6 45.72,133.6 J1.10 | v47.27,40.56 47.73,40.1 48.66,40.1 48.98,40.43 IC4.12 | v44.96,63.8 44.15,64.6 44.15,67.15 45.3,68.3 48.19,68.3 49.05,69.16 IC5.12 49.05,72.88 v49,72.92 | IC3.12 49.3,96.18 49.3,93.92 47.94,92.57 45.07,92.57 43.69,91.19 43.69,88.06 v46.23,85.64 | v56.63,85.17 58.02,85.17
RED1  (via drill 0.33)
  Top 0.254: v38.05,120.54 37.45,119.93 37.45,110.6 38.95,109.1 38.95,107.83 38.37,107.25 38.37,103.67 39.52,102.51 39.52,101.82 38.83,101.12 38.83,96.04 39.29,95.58 39.29,91.99 39.76,91.53 40.33,90.95 40.33,88.64 40.33,87.49 40.33,80.78 40.33,78.99 v40.62,78.7
  Bottom 0.254: R3.8 46.71,78.62 46.14,78.03 41.29,78.03 41.23,78.09 v40.62,78.7 | v38.05,120.54 35.54,120.54 B25.6
  Bottom 0.305: B1.6 8.89,121.92 15.62,121.92 B9.6 18.16,121.92 24.89,121.92 B17.6 27.43,121.92 34.16,121.92 B25.6
RED2  (via drill 0.33)  (1 unrouted)
  Top 0.254: v40,77.8 39.87,77.89 39.87,80.55 39.87,80.67 39.87,88.06 39.87,88.99 39.87,90.72 38.83,91.76 38.83,95.34 38.37,95.81 38.37,101.79 v38.74,102.16
  Bottom 0.254: R3.7 47.98,79.06 46.45,77.56 40.1,77.55 39.86,77.79 v40,77.8 | 38.56,102.28 B26.6
  Bottom 0.305: B2.6 8.89,106.68 15.62,106.68 B10.6 18.16,106.68 24.89,106.68 B18.6 27.43,106.68 34.16,106.68 B26.6
RED3
  Bottom 0.254: R3.6 49.25,79.64 46.69,77.08 38.37,77.08 37.1,78.36 37.1,88.5 B27.6
  Bottom 0.305: B3.6 8.89,91.44 15.62,91.44 B11.6 18.16,91.44 24.89,91.44 B19.6 27.43,91.44 34.16,91.44 B27.6
RED4
  Bottom 0.254: R3.5 50.52,79.87 50.5,79.86 47.27,76.62 46,76.62 43.8,74.43 42.18,72.81 40.1,72.81 39.06,72.81 36.94,74.93 B28.6
  Bottom 0.305: B4.6 8.89,76.2 15.62,76.2 B12.6 18.16,76.2 24.89,76.2 B20.6 27.43,76.2 34.16,76.2 B28.6
RED5  (via drill 0.33)
  Top 0.254: v42.41,62.87 42.18,62.76 42.18,62.64 42.18,59.87 v42.41,59.75
  Bottom 0.254: B29.6 35.49,59.75 41.86,59.75 v42.41,59.75 | R3.4 51.77,81.79 51.77,81.02 51.77,80.67 51.77,80.44 47.5,76.16 46.23,76.16 44.51,74.44 42.18,72.12 42.18,62.99 42.3,62.99 v42.41,62.87
  Bottom 0.305: B5.6 8.89,60.96 15.62,60.96 B13.6 18.16,60.96 24.89,60.96 B21.6 27.43,60.96 34.16,60.96 B29.6
RED6  (via drill 0.33)
  Top 0.254: v53.05,78.12 53.05,78.01 51.66,76.62 v51.66,52.7 | v51.66,52.7 | v51.66,52.7
  Bottom 0.254: R3.3 53.06,78.37 v53.05,78.12 | B30.6 35.48,44.49 40.91,49.93 43.1,52.12 51.08,52.12 v51.66,52.7
  Bottom 0.305: B6.6 8.89,45.72 15.62,45.72 B14.6 18.16,45.72 24.89,45.72 B22.6 27.43,45.72 34.16,45.72 B30.6
RED7  (via drill 0.33)
  Top 0.254: v54.32,74.43 54.32,52.35 51.31,49.35 44.73,49.35 44.49,49.12 v44.49,49.09
  Bottom 0.254: R3.2 54.33,78.36 v54.32,74.43 | v44.49,49.09 42.76,47.36 42.76,47.04 42.76,32.24 42.76,31.18 40.82,29.24 35.46,29.24 B31.6
  Bottom 0.305: B7.6 8.89,30.48 15.62,30.48 B15.6 18.16,30.48 24.89,30.48 B23.6 27.43,30.48 34.16,30.48 B31.6
RED8
  Top 0.254: 35.45,13.98 B32.6
  Bottom 0.254: R3.1 55.61,81.79 55.61,80.56 55.61,80.53 57.09,79.05 57.09,21.31 49.76,13.97 B32.6
  Bottom 0.305: B8.6 8.89,15.24 15.62,15.24 B16.6 18.16,15.24 24.89,15.24 B24.6 27.43,15.24 34.16,15.24 B32.6
ROW1
  Top 0.254: IC2.11 49.12,118.58 49.7,119.15 50.62,119.15 51.66,120.19 R2.5
  Bottom 0.254: D1.ANODE 20.32,132.54 21.03,133.25 40.56,133.25 43.69,130.13 53.86,130.13 55.7,128.28 55.7,123.21 R2.5
ROW2  (via drill 0.33)
  Top 0.254: R2.4 49.7,120.19 48.9,119.4 48.55,119.4 47.85,118.7 47.85,118.69 IC2.12 47.85,116.04 v47.85,115.92
  Bottom 0.254: D2.ANODE 20.32,116.24 20.69,116.61 33.17,116.61 33.86,115.92 v47.85,115.92
ROW3  (via drill 0.33)
  Top 0.254: IC2.13 46.58,119.17 R2.3 47.48,120.32 46.34,121.46 39.99,121.46 38.25,119.73 37.91,119.38 37.91,110.83 39.41,109.33 39.41,107.6 38.83,107.02 38.83,104.01 39.99,102.86 39.99,101.59 39.58,101.18 39.58,98.38 v39.62,98.12
  Bottom 0.254: D3.ANODE 20.34,100.35 20.34,101.93 21.03,102.63 33.05,102.63 37.56,98.12 v39.62,98.12
ROW4  (via drill 0.33)
  Top 0.254: R2.2 45.31,119.94 IC2.14 45.31,116.97 44.84,116.5 40.45,116.5 39.52,116.5 38.37,115.34 38.37,111.06 39.87,109.56 39.87,107.36 39.29,106.79 39.29,104.24 40.45,103.09 40.45,101.36 40.45,100.55 40.45,98.93 40.45,98.47 40.45,97.77 40.45,96.39 40.45,95.92 40.45,95.69 40.45,91.53 40.8,91.19 40.8,88.3 40.8,87.37 40.8,81.25 40.8,81.02 40.8,79.63 41.35,79.07 41.35,77.94 41.34,77.67 40.1,76.43 39.99,76.39 40.01,76.42 v40.01,76.37
  Bottom 0.254: D4.ANODE 20.34,85.11 20.34,86.91 20.92,87.49 35.25,87.49 36.64,86.1 36.64,78.12 38.37,76.39 39.9,76.39 39.87,76.39 v40.01,76.37
ROW5  (via drill 0.33)
  Top 0.254: IC2.3 45.31,110.25 R1.2 40.91,105.63 40.91,103.32 40.91,100.89 40.91,100.78 40.91,100.31 40.91,99.16 40.91,98.58 40.91,97.43 40.91,96.96 40.91,91.76 41.26,91.42 41.26,88.06 41.26,87.37 41.26,81.71 41.26,81.25 41.26,79.86 41.84,79.28 41.84,77.08 40.8,76.05 | v40.01,68.53 40.01,68.51 39.76,68.76 39.76,72 39.76,73.39 39.76,75 40.8,76.05 | 40.8,76.05
  Bottom 0.254: D5.ANODE 20.34,69.87 20.34,70.84 21.61,72.12 35.25,72.12 38.83,68.53 v40.01,68.53
ROW6  (via drill 0.33)
  Top 0.254: IC2.4 46.58,111.43 R1.3 46.88,109.04 45.01,109.04 41.37,105.4 41.37,100.89 41.37,91.99 41.72,91.65 41.72,87.83 41.72,86.91 41.72,81.71 41.72,81.48 41.72,80.09 42.3,79.51 42.3,76.85 41.26,75.81 | v40.47,57.32 40.56,57.32 40.22,57.54 40.22,65.53 40.22,67.61 40.8,68.19 40.8,68.76 40.22,69.34 40.22,74.77 41.26,75.81 | 41.26,75.81
  Bottom 0.254: D6.ANODE 20.34,54.63 20.34,55.7 21.96,57.32 v40.47,57.32
ROW7  (via drill 0.33)
  Top 0.254: IC2.5 47.85,111.87 49.56,110.16 | 49.56,110.16 50.28,110.16 R1.4 | v39.55,42.41 39.32,42.55 39.31,48.22 39.31,49.91 39.29,50.85 39.29,52.93 39.99,53.62 41.26,54.9 41.26,56.86 41.26,57.55 40.68,58.13 40.68,67.38 41.26,67.95 41.26,69 40.68,69.57 40.68,74.54 41.72,75.58 | 49.56,110.16 49.48,110.16 48.41,109.09 47.91,109.09 47.74,109.09 47.17,108.52 45.19,108.52 41.84,105.17 41.84,92.22 42.18,91.88 42.18,87.6 42.18,86.68 42.18,81.94 42.18,81.71 42.18,80.32 42.76,79.74 42.76,76.62 41.72,75.58 | 41.72,75.58
  Bottom 0.254: D7.ANODE 20.34,39.39 20.34,40.45 22.3,42.41 v39.55,42.41
ROW8  (via drill 0.33)
  Top 0.254: IC2.6 49.12,112.1 49.93,111.29 51.68,111.29 R1.5 53,110.07 54.43,108.64 54.43,103.09 51.77,100.43 45.19,100.43 42.65,97.89 42.65,92.8 42.65,92.11 42.65,87.37 42.65,86.45 42.65,82.17 42.65,81.94 42.65,80.55 43.22,79.97 43.22,76.39 42.18,75.35 41.14,74.31 41.14,69.8 41.72,69.23 41.72,67.72 41.14,67.15 41.14,58.36 41.72,57.78 41.72,54.66 39.76,52.7 39.76,51.08 39.78,50.13 39.78,47.99 39.78,43.31 40.33,42.76 40.33,42.07 39.76,41.49 39.76,36.06 39.76,35.13 39.76,27.99 v40.13,27.74
  Bottom 0.254: D8.ANODE 20.34,24.15 20.34,25.08 23,27.74 v40.13,27.74
SC  (via drill 0.33)
  Top 0.254: 44.04,114.08 v44.15,114.18 44.04,114.08 | 44.04,114.08 IC2.2 44.04,114.08 | IC1.11 48.98,130.34 J1.8 | v44.49,44.03 40.8,47.73 40.8,50.39 42.65,52.24 | 42.65,52.24 | 42.65,52.24 43.69,53.28 43.69,65.99 v47.85,70.15 44.18,73.82 44.15,73.82 v44.15,95.34 | v44.15,95.34 44.03,95.46 | 44.03,95.46 v44.15,95.34 | v44.15,95.34 44.03,95.46
  Bottom 0.254: 52.11,7.62 54.09,9.59 55.59,9.59 57.55,11.56 57.55,82.86 55.82,84.6 55.82,85.87 57.55,87.6 57.55,133.83 57.55,134.06 55.47,136.14 47.38,136.14 47.04,135.79 47.04,134.92 J1.7 J1.8 48.27,131.06 54.32,131.06 56.63,128.75 56.63,119.96 55.82,119.15 55.73,119.15 53.97,119.15 53.25,118.43 52.7,118.43 49.01,114.74 45.03,114.74 44.69,114.74 44.15,114.2 v44.15,114.18 44.15,113.49 41.72,111.06 41.6,110.95 41.6,102.51 41.6,97.89 | 52.11,7.62 J2.8 | 52.11,7.62 52.07,7.58 J2.7 | 45.3,94.19 47.62,94.19 48.08,94.65 48.08,96.14 IC3.11 | IC4.11 47.62,42.69 47.62,41.95 47.04,41.37 44.96,41.37 44.49,41.84 v44.49,44.03 | 47.78,70.22 v47.85,70.15 47.85,71.49 IC5.11 | 45.3,94.19 | 45.3,94.19 v44.15,95.34 41.6,97.89 | 41.6,97.89
SEL1  (via drill 0.33)
  Top 0.254: v50.16,124.58 50.25,124.49 IC1.7
  Top 0.305: B8.5 6.35,15.24 6.35,27.94 B7.5 6.35,30.48 6.35,43.18 B6.5 6.35,45.72 6.35,58.42 B5.5 6.35,60.96 6.35,73.66 B4.5 6.35,76.2 6.35,88.9 B3.5 6.35,91.44 6.35,104.01 5.08,105.28 B2.5 6.35,106.68 v6.35,119.38 B1.5
  Bottom 0.254: v6.35,119.38 38.48,119.38 39.52,120.42 39.52,123.54 42.41,126.43 48.31,126.43 v50.16,124.58
SEL2  (via drill 0.33)
  Top 0.254: 15.62,119.38 15.6,119.36 v15.6,118.58 | v49,124.58 49,122.53 IC1.6
  Top 0.305: B16.5 15.62,15.24 15.62,27.94 B15.5 15.62,30.48 15.62,43.18 B14.5 15.62,45.72 15.62,58.42 B13.5 15.62,60.96 15.62,73.66 B12.5 15.62,76.2 15.62,88.9 B11.5 15.62,91.44 15.62,104.14 B10.5 15.62,106.68 15.62,119.38 B9.5
  Bottom 0.254: v15.6,118.58 38.37,118.58 39.99,120.19 39.99,123.31 42.65,125.97 47.62,125.97 v49,124.58
SEL3  (via drill 0.33)
  Top 0.254: 24.89,119.38 24.89,117.81 v24.85,117.77 | v47.73,124.58 47.73,122.53 IC1.5
  Top 0.305: B24.5 24.89,15.24 24.89,27.94 B23.5 24.89,30.48 24.89,43.18 B22.5 24.89,45.72 24.89,58.42 B21.5 24.89,60.96 24.89,73.66 B20.5 24.89,76.2 24.89,88.9 B19.5 24.89,91.44 24.89,104.14 B18.5 24.89,106.68 24.89,119.38 B17.5
  Bottom 0.254: v24.85,117.77 38.25,117.77 40.45,119.96 40.45,123.08 42.88,125.51 46.81,125.51 v47.73,124.58
SEL4  (via drill 0.33)
  Top 0.254: 34.16,119.38 34.16,117 v34.21,116.96 | v46.46,124.58 46.46,122.53 IC1.4
  Top 0.305: B32.5 34.16,15.24 34.16,27.94 B31.5 34.16,30.48 34.16,43.18 B30.5 34.16,45.72 34.16,58.42 B29.5 34.16,60.96 34.16,73.66 B28.5 34.16,76.2 34.16,88.9 B27.5 34.16,91.44 34.16,104.14 B26.5 34.16,106.68 34.16,119.38 B25.5
  Bottom 0.254: v34.21,116.96 38.14,116.96 40.91,119.73 40.91,122.85 43.11,125.05 46,125.05 v46.46,124.58
SI-INPUT/J1  (via drill 0.33)
  Top 0.254: v55.7,118.34 55.33,118.02 IC2.9
  Bottom 0.254: J1.5 50.75,133.65 55.06,133.65 57.09,131.62 57.09,119.73 v55.7,118.34
SI-OUTPUT  (via drill 0.33)
  Top 0.254: R2.6 54.19,119.15 51.31,119.15 50.51,118.35 IC2.10 50.39,116.84 56.63,110.6 56.63,105.17 56.63,104.82 56.63,104.59 52.58,100.55 52.58,97.31 57.55,92.34 57.55,79.97 57.55,79.63 v56.28,78.36 | v48.31,14.73 48.31,14.21 48.31,6.24 49.47,5.08 J2.5
  Bottom 0.254: v56.28,78.36 56.63,77.89 56.63,60.67 56.63,60.56 56.63,21.61 49.75,14.73 v48.31,14.73
SO-INPUT/J1
  Top 0.254: IC1.14 45.17,129.19 45.17,130.03 43.34,131.87 43.34,132.79 44.15,133.6 48.27,133.6 J1.6
SO-LINK1  (via drill 0.33)
  Top 0.254: v56.8,117.94 56.8,120.6 54.9,122.5 53.51,122.5 51.52,124.49 IC1.9
  Bottom 0.254: IC3.14 51.77,96.25 51.77,100.43 57.09,105.75 57.09,117.65 56.74,118 v56.8,117.94
SO-LINK2  (via drill 0.33)
  Top 0.254: v44.96,98 44.84,98.12 43.57,98.12 43.11,97.66 43.11,82.52 43.11,82.17 43.11,80.78 43.69,80.21 43.69,75.93 43.22,75.47 43.22,64.26 43.22,63.33 43.22,55.47 42.18,54.43 | 42.18,54.43 | 42.18,54.43 40.33,52.58 40.33,51.43 40.33,50.27 40.33,43.45 44.73,39.06 v50.85,39.06
  Bottom 0.254: IC3.9 45.49,96.18 45.49,97.47 v44.96,98 | v50.85,39.06 51.52,39.73 IC4.14
SO-LINK3  (via drill 0.33)
  Top 0.254: v45.3,44.96 41.26,49 41.26,50.16 44.15,53.05 44.15,65.76 46.23,67.84 v49.7,67.84
  Bottom 0.254: IC4.9 45.19,42.8 45.19,43.45 45.3,43.57 v45.3,44.96 | v49.7,67.84 51.59,69.74 IC5.14
SO-OUTPUT/J2  (via drill 0.33)
  Top 0.254: v49.58,15.6 49.58,7.67 J2.6
  Bottom 0.254: IC5.9 45.24,68.93 43.69,67.38 43.69,63.22 46.58,60.44 | 46.58,60.44 | 46.58,60.44 | 46.58,60.44 55.01,60.44 56.17,59.29 56.17,22.19 49.93,15.95 v49.58,15.6

### Text on the board
tPlace: B1 | B9 | B17 | B25 | B8 | B16 | B24 | B32
tNames: ButoMatV1.1.0
bNames: SC | SI | 5V | RC2 | GND | RC1 | SC | SO | 5V | 5V | SO | SC | GND | RC1 | RC2 | SI | 5V